# Altium schematic sheet CTR-Lower-Main-Board-Rev-C-LED-5.SchDoc: CTR Controller - BTLE
size B; Author: TWL; Organization: OLogic, Inc.; DocumentNumber: 112216; Revision: A; SheetNumber: 1; SheetTotal: 4; PageSetup: Record=PageOptions|CenterHorizontal=True|CenterVertical=True|PrintScale=0.70|XCorrection=1.00|YCorrection=1.00|PrintKind=0|BorderSize=5000000|LeftOffset=0|BottomOffset=0|Orientation=2|PaperLength=1000|PaperWidth=1000|Scale=100|PaperSource=15|PrintQuality=600|MediaType=1|DitherType=10|PrintScaleMode=1|PaperKind=Letter|PaperIndex=1
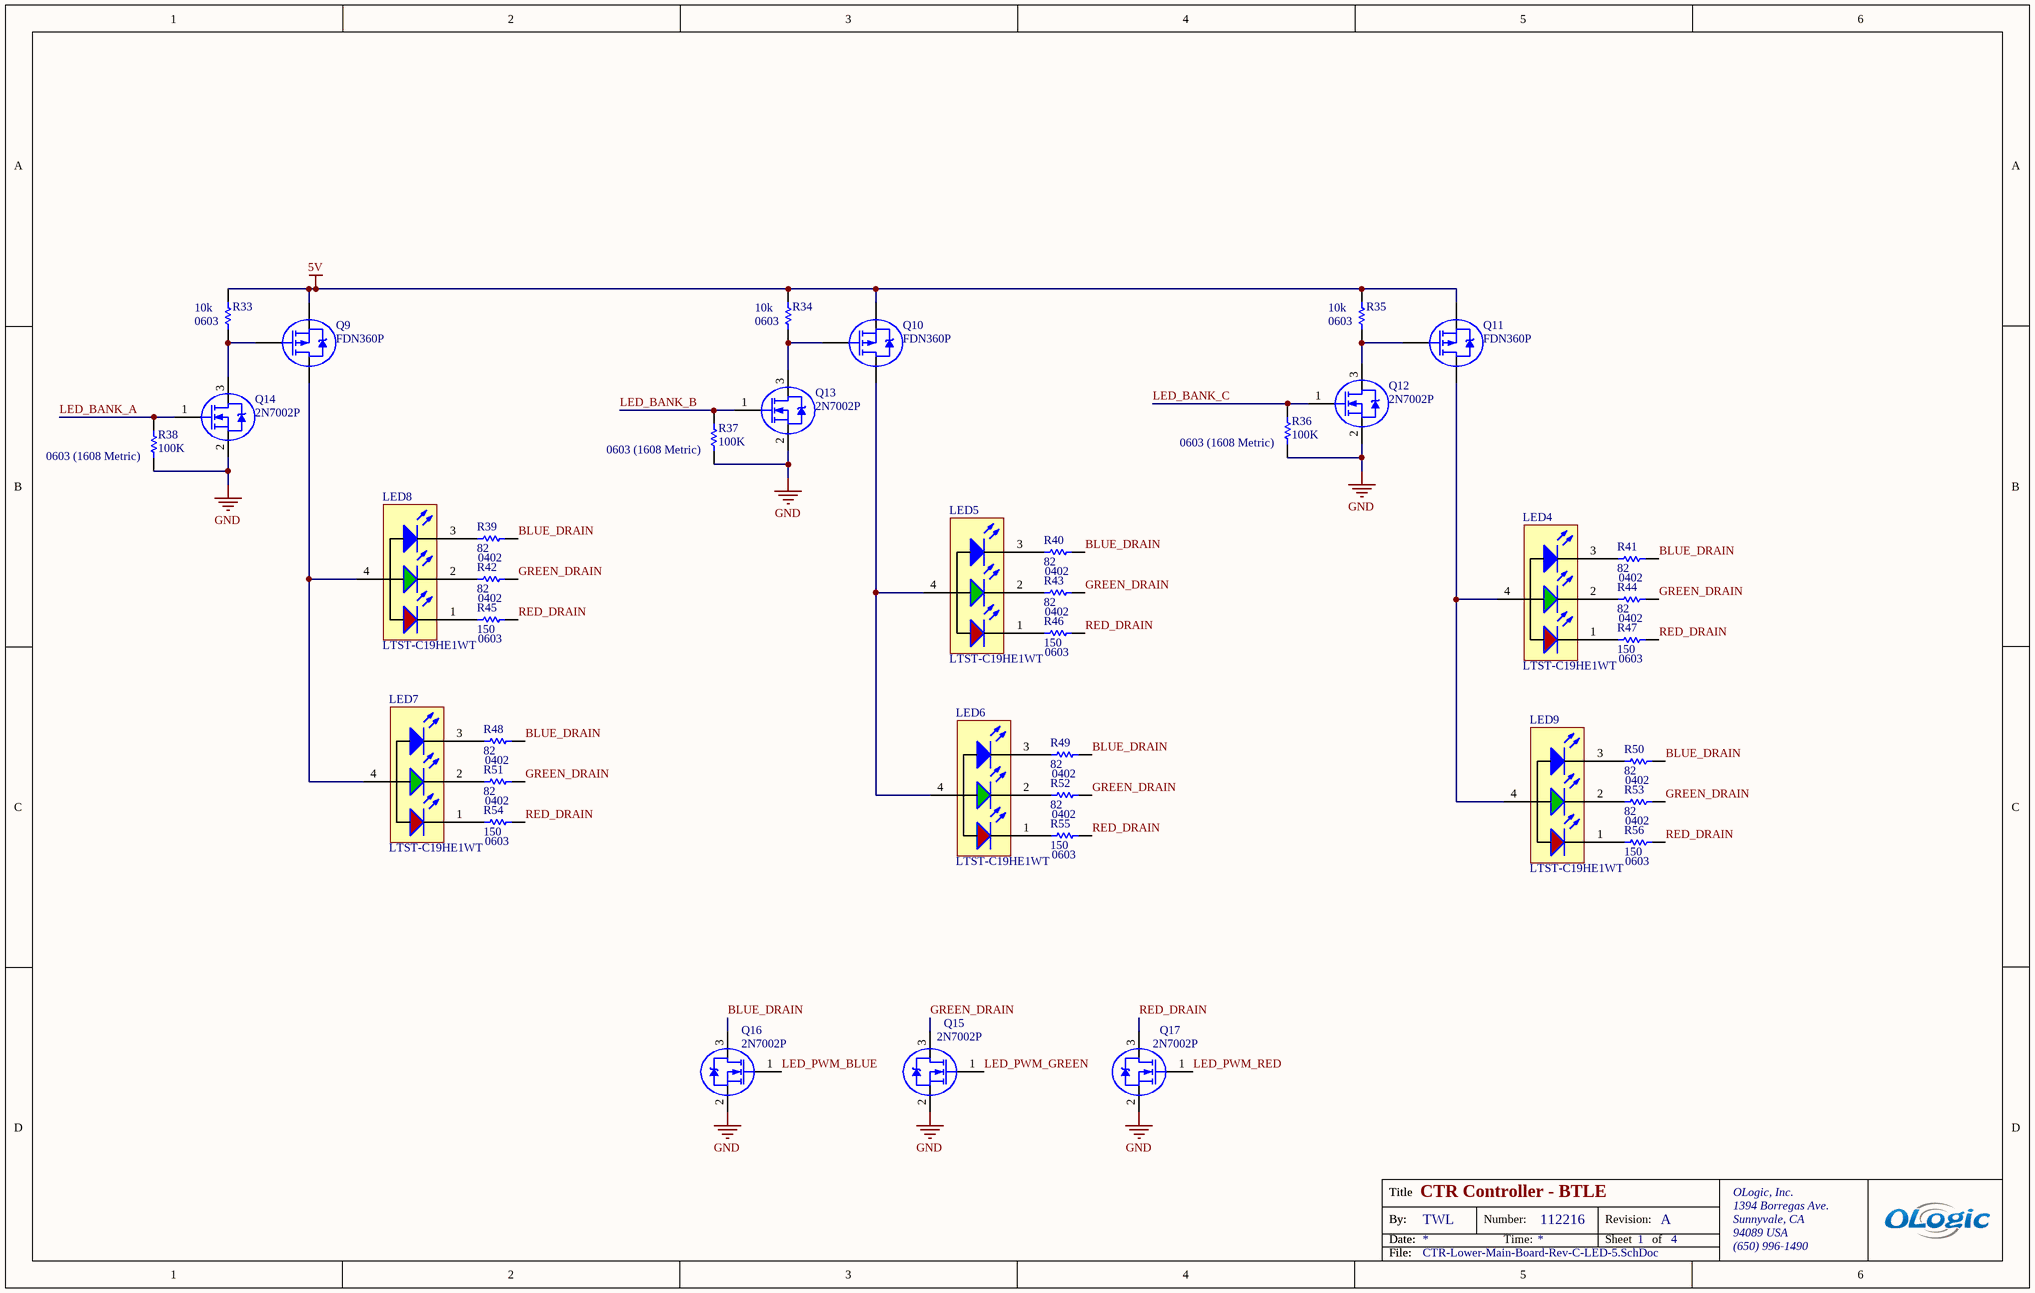
[diagram p0: CTR-Lower-Main-Board-Rev-C-LED-5.SchDoc]

## Parts
LED4  Red, Green, Blue (RGB)  [LTST-C19HE1WT]  (value not drawn)
LED5  Red, Green, Blue (RGB)  [LTST-C19HE1WT]  (value not drawn)
LED6  Red, Green, Blue (RGB)  [LTST-C19HE1WT]  (value not drawn)
LED7  Red, Green, Blue (RGB)  [LTST-C19HE1WT]  (value not drawn)
LED8  Red, Green, Blue (RGB)  [LTST-C19HE1WT]  (value not drawn)
LED9  Red, Green, Blue (RGB)  [LTST-C19HE1WT]  (value not drawn)
Q9  FDN360P  [SOT23]
Q10  FDN360P  [SOT23]
Q11  FDN360P  [SOT23]
Q12  2N7002P  [SOT23]
Q13  2N7002P  [SOT23]
Q14  2N7002P  [SOT23]
Q15  2N7002P  [SOT23]
Q16  2N7002P  [SOT23]
Q17  2N7002P  [SOT23]
R33  Resistance (Ohms): 10k  Supplier Device Package: 0603  [RESC0603(1608)_N]  (hidden comment: 10K 1%)
R34  Resistance (Ohms): 10k  Supplier Device Package: 0603  [RESC0603(1608)_N]  (hidden comment: 10K 1%)
R35  Resistance (Ohms): 10k  Supplier Device Package: 0603  [RESC0603(1608)_N]  (hidden comment: 10K 1%)
R36  100K  Package / Case: 0603 (1608 Metric)  [RESC0603(1608)_N]
R37  100K  Package / Case: 0603 (1608 Metric)  [RESC0603(1608)_N]
R38  100K  Package / Case: 0603 (1608 Metric)  [RESC0603(1608)_N]
R39  Supplier Device Package: 0402  Resistance (Ohms): 82  [RESC0402(1005)_N]  (hidden comment: ?)
R40  Supplier Device Package: 0402  Resistance (Ohms): 82  [RESC0402(1005)_N]  (hidden comment: ?)
R41  Supplier Device Package: 0402  Resistance (Ohms): 82  [RESC0402(1005)_N]  (hidden comment: ?)
R42  Supplier Device Package: 0402  Resistance (Ohms): 82  [RESC0402(1005)_N]  (hidden comment: ?)
R43  Supplier Device Package: 0402  Resistance (Ohms): 82  [RESC0402(1005)_N]  (hidden comment: ?)
R44  Supplier Device Package: 0402  Resistance (Ohms): 82  [RESC0402(1005)_N]  (hidden comment: ?)
R45  150  Supplier Device Package: 0603  [RESC0603(1608)_N]
R46  150  Supplier Device Package: 0603  [RESC0603(1608)_N]
R47  150  Supplier Device Package: 0603  [RESC0603(1608)_N]
R48  Supplier Device Package: 0402  Resistance (Ohms): 82  [RESC0402(1005)_N]  (hidden comment: ?)
R49  Supplier Device Package: 0402  Resistance (Ohms): 82  [RESC0402(1005)_N]  (hidden comment: ?)
R50  Supplier Device Package: 0402  Resistance (Ohms): 82  [RESC0402(1005)_N]  (hidden comment: ?)
R51  Supplier Device Package: 0402  Resistance (Ohms): 82  [RESC0402(1005)_N]  (hidden comment: ?)
R52  Supplier Device Package: 0402  Resistance (Ohms): 82  [RESC0402(1005)_N]  (hidden comment: ?)
R53  Supplier Device Package: 0402  Resistance (Ohms): 82  [RESC0402(1005)_N]  (hidden comment: ?)
R54  150  Supplier Device Package: 0603  [RESC0603(1608)_N]
R55  150  Supplier Device Package: 0603  [RESC0603(1608)_N]
R56  150  Supplier Device Package: 0603  [RESC0603(1608)_N]

## Nets
5V: Q9.2(S) Q10.2(S) Q11.2(S) R33.2 R34.2 R35.2
GND: Q12.2(S) Q13.2(S) Q14.2(S) Q15.2(S) Q16.2(S) Q17.2(S) R36.1 R37.1 R38.1
BLUE_DRAIN: Q16.3(D) R39.1 R40.1 R41.1 R48.1 R49.1 R50.1
GREEN_DRAIN: Q15.3(D) R42.1 R43.1 R44.1 R51.1 R52.1 R53.1
LED_BANK_A: Q14.1(G) R38.2
LED_BANK_B: Q13.1(G) R37.2
LED_BANK_C: Q12.1(G) R36.2
LED_PWM_BLUE: Q16.1(G)
LED_PWM_GREEN: Q15.1(G)
LED_PWM_RED: Q17.1(G)
RED_DRAIN: Q17.3(D) R45.1 R46.1 R47.1 R54.1 R55.1 R56.1
NetLED4_1: LED4.1(R) R47.2
NetLED4_2: LED4.2(G) R44.2
NetLED4_3: LED4.3(B) R41.2
NetLED4_4: LED4.4(Anode) LED9.4(Anode) Q11.3(D)
NetLED5_1: LED5.1(R) R46.2
NetLED5_2: LED5.2(G) R43.2
NetLED5_3: LED5.3(B) R40.2
NetLED5_4: LED5.4(Anode) LED6.4(Anode) Q10.3(D)
NetLED6_1: LED6.1(R) R55.2
NetLED6_2: LED6.2(G) R52.2
NetLED6_3: LED6.3(B) R49.2
NetLED7_1: LED7.1(R) R54.2
NetLED7_2: LED7.2(G) R51.2
NetLED7_3: LED7.3(B) R48.2
NetLED7_4: LED7.4(Anode) LED8.4(Anode) Q9.3(D)
NetLED8_1: LED8.1(R) R45.2
NetLED8_2: LED8.2(G) R42.2
NetLED8_3: LED8.3(B) R39.2
NetLED9_1: LED9.1(R) R56.2
NetLED9_2: LED9.2(G) R53.2
NetLED9_3: LED9.3(B) R50.2
NetQ9_1: Q9.1(G) Q14.3(D) R33.1
NetQ10_1: Q10.1(G) Q13.3(D) R34.1
NetQ11_1: Q11.1(G) Q12.3(D) R35.1

## Notes on the sheet
- Title
- By:
- Date:
- Number:
- Time:
- Revision:
- Sheet
- of
- OLogic, Inc.
- 1394 Borregas Ave.
- Sunnyvale, CA
- 94089 USA
- File:
- (650) 996-1490

## Library data of the parts
LED4-LED9 = LTST-C19HE1WT: LED RGB 624/525/470NM DIFF SMD; Manufacturer: Lite-On Inc.; Lens Color: White; Lens Transparency: Diffused; Millicandela Rating: 112.5mcd Red, 281mcd Green, 104mcd Blue; Lens Style/Size: Rectangle with Flat Top, 1.15mm x 1.60mm; Voltage - Forward (Vf) (Typ): 2.1V Red, 3.35V Green, 3.35V Blue; Current - Test: 20mA Red, 20mA Green, 20mA Blue; Viewing Angle: 130°; Wavelength - Dominant: 624nm Red, 525nm Green, 470nm Blue; Wavelength - Peak: 632nm Red, 520nm Green, 468nm Blue; Supplier 1: Digi-Key; RoHS: RoHS Compliant; Category: Optoelectronics; Stock 1: 369310; Pricing 1: 1=0.59, 10=0.424, 25=0.3464, 100=0.277, 250=0.23372, 500=0.19912, 1000=0.15583 (USD); Packaging: Cut Tape (CT); Part Status: Active; Color: Red, Green, Blue (RGB); Mounting Type: Surface Mount; Features: -; Package / Case: 0606 (1616 Metric); Supplier Device Package: *; Size / Dimension: 1.60mm L x 1.60mm W; Height (Max): 0.35mm; ComponentLink1URL: http://optoelectronics.liteon.com/upload/download/DS22-2008-0044/S_110_LTST-C19HE1WT.pdf; ComponentLink1Description: http://optoelectronics.liteon.com/upload/download/DS22-2008-0044/S_110_LTST-C19HE1WT.pdf; Supplier Part Number 1: 160-2162-1-ND; Manufacturer Part Number: LTST-C19HE1WT
Q9-Q11 = FDN360P: Single P-Channel MOSFET; Manufacturer: Fairchild Semi; Vendor: Digikey; FET Type: MOSFET P-Channel, Metal Oxide; FET Feature: Logic Level Gate; Drain to Source Voltage (Vdss): 30V; Current - Continuous Drain (Id) @ 25°C: 2A (Ta); Rds On (Max) @ Id, Vgs: 80 mOhm @ 2A, 10V; Vgs(th) (Max) @ Id: 3V @ 250µA; Gate Charge (Qg) @ Vgs: 9nC @ 10V; Input Capacitance (Ciss) @ Vds: 298pF @ 15V; Power - Max: 460mW; PN: FDN360P; Supplier 1: Digi-Key; Manufacturer Part Number: FDN360P; RoHS: RoHS Compliant; Category: Discrete Semiconductor Products; Stock 1: 39115; Pricing 1: 1=0.56, 10=0.441, 25=0.372, 100=0.3032, 250=0.25116, 500=0.20748, 1000=0.1554 (USD); Packaging: Cut Tape (CT); Mounting Type: Surface Mount; Package / Case: TO-236-3, SC-59, SOT-23-3; Supplier Device Package: 3-SSOT; ComponentLink1URL: http://www.fairchildsemi.com/ds/FD/FDN360P.pdf; ComponentLink1Description: http://www.fairchildsemi.com/ds/FD/FDN360P.pdf; Supplier Part Number 1: FDN360PCT-ND; ClassName: power
Q12-Q17 = 2N7002P: MOSFET N-CH 60V 0.36A SOT-23; Manufacturer: NXP Semiconductors; Manufacturer Part Number: 2N7002P,235; FET Type: MOSFET N-Channel, Metal Oxide; FET Feature: Logic Level Gate; Current - Continuous Drain (Id) @ 25°C: 360mA (Ta); Rds On (Max) @ Id, Vgs: 1.6 Ohm @ 500mA, 10V; Vgs(th) (Max) @ Id: 2.4V @ 250µA; Gate Charge (Qg) @ Vgs: 0.8nC @ 4.5V; Input Capacitance (Ciss) @ Vds: 50pF @ 10V; Power - Max: 350mW; Supplier 1: Digi-Key; RoHS: RoHS Compliant; Category: Discrete Semiconductor Products; Stock 1: 4190; Pricing 1: 1=0.15, 10=0.135, 25=0.1224, 100=0.0881, 250=0.05188, 500=0.04304, 1000=0.02936, 2500=0.02498, 5000=0.02252 (USD); Packaging: Cut Tape (CT); Drain to Source Voltage (Vdss): 60V; Mounting Type: Surface Mount; Package / Case: TO-236-3, SC-59, SOT-23-3; Supplier Device Package: SOT-23 (TO-236AB); ComponentLink1URL: http://www.nxp.com/documents/data_sheet/2N7002P.pdf; ComponentLink1Description: http://www.nxp.com/documents/data_sheet/2N7002P.pdf; Supplier Part Number 1: 568-11588-1-ND; ClassName: 5V
R33-R35 = RES 10K OHM 1/10W 1% 0603 SMD: 10K 0603; Manufacturer: Panasonic Electronic Components; Manufacturer Part Number: ERJ-3EKF1002V; Power (Watts): 0.1W, 1/10W; Temperature Coefficient: ±100ppm/°C; Category: Resistors; Supplier 1: Digi-Key; RoHS: RoHS Compliant; Stock 1: 5046430; Pricing 1: 1=0.1, 50=0.015, 100=0.0114, 250=0.00844, 500=0.00624, 1000=0.00416, 2500=0.00351 (USD); Packaging: Cut Tape (CT); Tolerance: ±1%; Composition: Thick Film; Features: -; Package / Case: 0603 (1608 Metric); Size / Dimension: 0.063" L x 0.031" W (1.60mm x 0.80mm); Height: 0.022" (0.55mm); Number of Terminations: 2; ComponentLink1URL: http://industrial.panasonic.com/www-cgi/jvcr13pz.cgi?E+PZ+3+AOA0002+ERJ3EKF1002V+7+WW; ComponentLink1Description: http://industrial.panasonic.com/www-cgi/jvcr13pz.cgi?E+PZ+3+AOA0002+ERJ3EKF1002V+7+WW; Supplier Part Number 1: P10.0KHCT-ND
R36-R38 = RES 100K OHM 5% 1/4W 0603: 100K 0603; Manufacturer: Rohm Semiconductor; Manufacturer Part Number: ESR03EZPJ104; Tolerance: ±5%; Power (Watts): 0.25W, 1/4W; Temperature Coefficient: ±200ppm/°C; Supplier 1: Digi-Key; RoHS: RoHS Compliant; Category: Resistors; Stock 1: 33839; Pricing 1: 1=0.1, 10=0.079, 25=0.0544, 100=0.0303, 250=0.0236, 500=0.01876, 1000=0.01331 (USD); Packaging: Cut Tape (CT); Resistance (Ohms): 100k; Composition: Thick Film; Features: Automotive AEC-Q200, Pulse Withstanding; Operating Temperature: -55°C ~ 155°C; Supplier Device Package: 0603 (1608 Metric); Size / Dimension: 0.063" L x 0.031" W (1.60mm x 0.80mm); Height: 0.022" (0.55mm); Number of Terminations: 2; ComponentLink1URL: http://rohmfs.rohm.com/en/products/databook/datasheet/passive/resistor/chip_resistor/esr.pdf; ComponentLink1Description: http://rohmfs.rohm.com/en/products/databook/datasheet/passive/resistor/chip_resistor/esr.pdf; Supplier Part Number 1: RHM100KDCT-ND
R39-R44 R48-R53 = RES 82 OHM 1% 1/10W 0402: 82 0402; Manufacturer: Panasonic Electronic Components; Manufacturer Part Number: ERJ-2RKF82R0X; Tolerance: ±1%; Power (Watts): 0.1W, 1/10W; Temperature Coefficient: ±100ppm/°C; Supplier 1: Digi-Key; RoHS: RoHS Compliant; Category: Resistors; Stock 1: 91946; Pricing 1: 1=0.1, 50=0.015, 100=0.011, 250=0.0084, 500=0.00674, 1000=0.00496, 5000=0.00355 (USD); Packaging: Cut Tape (CT); Composition: Thick Film; Features: Automotive AEC-Q200; Operating Temperature: -55°C ~ 155°C; Package / Case: 0402 (1005 Metric); Size / Dimension: 0.039" L x 0.020" W (1.00mm x 0.50mm); Height: 0.016" (0.40mm); Number of Terminations: 2; ComponentLink1URL: http://industrial.panasonic.com/www-cgi/jvcr13pz.cgi?E+PZ+3+AOA0002+ERJ2RKF82R0X+7+WW; ComponentLink1Description: http://industrial.panasonic.com/www-cgi/jvcr13pz.cgi?E+PZ+3+AOA0002+ERJ2RKF82R0X+7+WW; Supplier Part Number 1: P82.0LCT-ND; Creator: osman
R45-R47 R54-R56 = RES 150 OHM 1/10W 1% 0603 SMD: 150 0603; Manufacturer: Yageo; Manufacturer Part Number: RC0603FR-07150RL; Tolerance: ±1%; Power (Watts): 0.1W, 1/10W; Temperature Coefficient: ±100ppm/°C; Supplier 1: Digi-Key; RoHS: RoHS Compliant; Category: Resistors; Stock 1: 481223; Pricing 1: 1=0.1, 10=0.015, 25=0.0108, 100=0.006, 250=0.00456, 500=0.00364, 1000=0.00268, 2500=0.00233 (USD); Packaging: Cut Tape (CT); Resistance (Ohms): 150; Composition: Thick Film; Features: -; Package / Case: 0603 (1608 Metric); Size / Dimension: 0.063" L x 0.031" W (1.60mm x 0.80mm); Height: 0.022" (0.55mm); Number of Terminations: 2; ComponentLink1URL: http://www.yageo.com/documents/recent/PYu-RC0603_51_RoHS_L_4.pdf; ComponentLink1Description: http://www.yageo.com/documents/recent/PYu-RC0603_51_RoHS_L_4.pdf; Supplier Part Number 1: 311-150HRCT-ND